# Altium schematic sheet 3.3V_&_5V_DC-DC_PowerSupply.SchDoc
size Letter
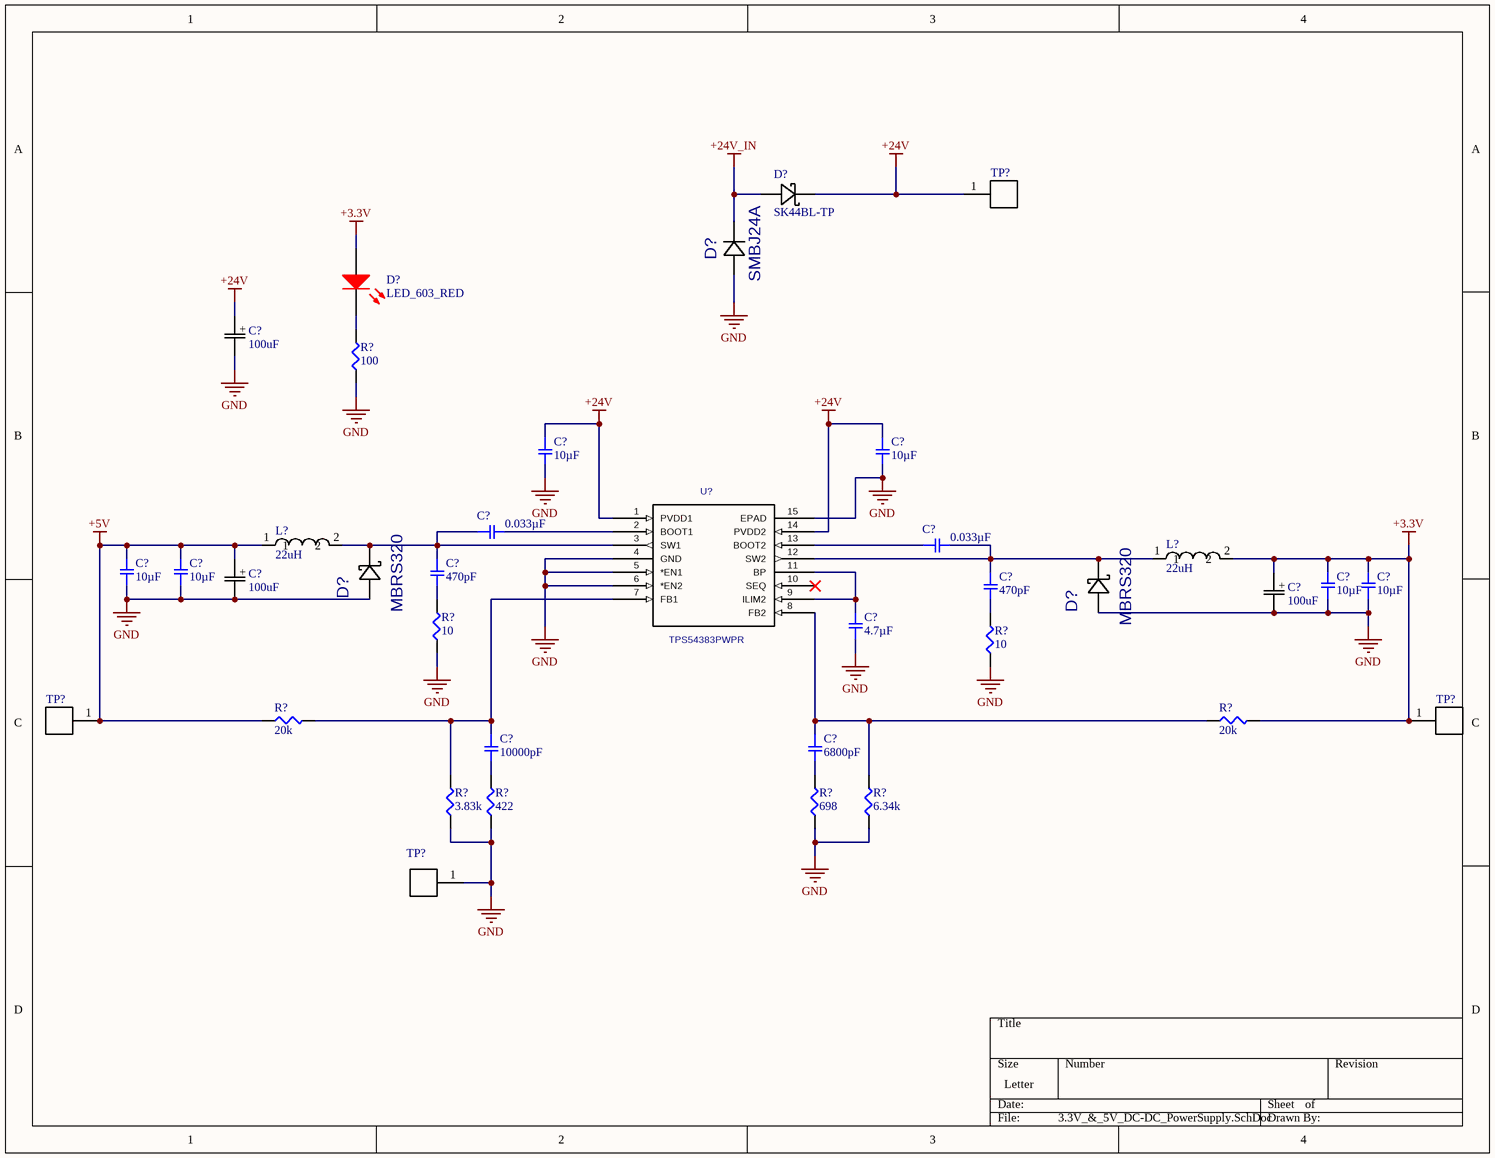
[diagram p0: 3.3V_&_5V_DC-DC_PowerSupply.SchDoc]

## Parts
(Parts that share a designator on the sheet are numbered #1, #2 ... from top to bottom, then left to right.)
C?#1  100uF  [Capacitor SMD 6.6mm]
C?#2  10µF  [SMD-1206C]
C?#3  10µF  [SMD-1206C]
C?#4  0.033µF  [SMD-0603C]
C?#5  0.033µF  [SMD-0603C]
C?#6  100uF  [Capacitor SMD 6.6mm]
C?#7  10µF  [SMD-0603C]
C?#8  10µF  [SMD-0603C]
C?#9  470pF  [SMD-0603C]
C?#10  100uF  [Capacitor SMD 6.6mm]
C?#11  470pF  [SMD-0603C]
C?#12  10µF  [SMD-0603C]
C?#13  10µF  [SMD-0603C]
C?#14  4.7µF  [SMD-0603C]
C?#15  10000pF  [SMD-0603C]
C?#16  6800pF  [SMD-0603C]
D?#1  SK44BL-TP  [SMB]
D?#2  SMBJ24A  [SMB]
D?#3  LED_603_RED  [LED_603]
D?#4  MBRS320  [DIODE_DO214AA]
D?#5  MBRS320  [DIODE_DO214AA]
L?#1  22uH  [Inductor SMD 4mm]
L?#2  22uH  [Inductor SMD 4mm]
R?#1  100  [SMD-0603-RES]
R?#2  10  [SMD-0603-RES]
R?#3  10  [SMD-0603-RES]
R?#4  20k  [SMD-0603-RES]
R?#5  20k  [SMD-0603-RES]
R?#6  3.83k  [SMD-0603-RES]
R?#7  422  [SMD-0603-RES]
R?#8  698  [SMD-0603-RES]
R?#9  6.34k  [SMD-0603-RES]
TP?#1  24V  [TE_RCU-0C]  (value not drawn)
TP?#2  5V  [TE_RCU-0C]  (value not drawn)
TP?#3  3.3V  [TE_RCU-0C]  (value not drawn)
TP?#4  GND  [TE_RCU-0C]  (value not drawn)
U?  TPS54383PWPR  [PWP14_2P31X2P400]

## Nets
+3.3V: C?#10.1 C?#12.2 C?#13.2 D?#3.1(A) L?#2.2 R?#5.2 TP?#3.1
+5V: C?#6.1 C?#7.2 C?#8.2 L?#1.1 R?#4.1 TP?#2.1
+24V: C?#1.1 C?#2.1 C?#3.1 D?#1.1 TP?#1.1 U?.1(PVDD1) U?.14(PVDD2)
+24V_IN: D?#1.2 D?#2.1
GND: C?#1.2 C?#2.2 C?#3.2 C?#6.2 C?#7.1 C?#8.1 C?#10.2 C?#12.1 C?#13.1 C?#14.1 D?#2.2 D?#4.2 D?#5.2 R?#1.1 R?#2.1 R?#3.1 R?#6.1 R?#7.1 R?#8.1 R?#9.1 TP?#4.1 U?.4(GND) U?.5(*EN1) U?.6(*EN2) U?.15(EPAD)
NetC?#4_1: C?#4.1 C?#9.1 D?#4.1 L?#1.2 U?.3(SW1)
NetC?#4_2: C?#4.2 U?.2(BOOT1)
NetC?#5_1: C?#5.1 U?.13(BOOT2)
NetC?#5_2: C?#5.2 C?#11.1 D?#5.1 L?#2.1 U?.12(SW2)
NetC?#9_2: C?#9.2 R?#2.2
NetC?#11_2: C?#11.2 R?#3.2
NetC?#14_2: C?#14.2 U?.9(ILIM2) U?.11(BP)
NetC?#15_1: C?#15.1 R?#4.2 R?#6.2 U?.7(FB1)
NetC?#15_2: C?#15.2 R?#7.2
NetC?#16_1: C?#16.1 R?#5.1 R?#9.2 U?.8(FB2)
NetC?#16_2: C?#16.2 R?#8.2
NetD?#3_2: D?#3.2(K) R?#1.2

Not connected (* = marked no-connect by the designer): U? 10(SEQ)*

## Notes on the sheet
- (in symbol Capacitor SMD 6.6mm) +

## Library data of the parts
C?#1 C?#6 C?#10 = Capacitor SMD 6.6mm
C?#2 C?#3 = GRM31CR61H106KA12L: CAP CER 10UF 50V X5R 1206; Manufacturer: Murata Electronics North America; Factory Stock: 0; Unit Price (USD): 0.65; Minimum Quantity: 1; Tolerance: ±10%; Datasheets: http://www.murata.com/~/media/webrenewal/support/library/catalog/products/capacitor/mlcc/c02e.pdf; Image: //media.digikey.com/Renders/Murata%20Renders/GR331BD72E473KW01L.jpg; Digi-Key Part Number: 490-5961-1-ND; Part Number: GRM31CR61H106KA12L; Quantity Available: 86736; @ qty: 0; Packaging: Cut Tape (CT); Series: GRM; Part Status: Active; Value: 10µF; Voltage: 50V; Temperature Coefficient: X5R; Operating Temperature: -55°C ~ 85°C; Features: -; Ratings: -; Applications: General Purpose; Mounting Type: Surface Mount, MLCC; Package / Case: 1206 (3216 Metric); Size / Dimension: 0.126" L x 0.063" W (3.20mm x 1.60mm); Height - Seated (Max): -; Thickness (Max): 0.071" (1.80mm); Lead Spacing: -; Lead Style: -
C?#4 C?#5 = GCJ188R71H333KA12D: CAP CER 0.033UF 50V X7R 0603; Manufacturer: Murata Electronics North America; Factory Stock: 0; Unit Price (USD): 0.23; Minimum Quantity: 1; Tolerance: ±10%; Datasheets: http://www.murata.com/~/media/webrenewal/support/library/catalog/products/capacitor/mlcc/c03e.ashx; Image: //media.digikey.com/Renders/Murata%20Renders/0603%28LQG18%29.jpg; Digi-Key Part Number: 490-5852-1-ND; Part Number: GCJ188R71H333KA12D; Quantity Available: 16459; @ qty: 0; Packaging: Cut Tape (CT); Series: GCJ; Part Status: Active; Value: 0.033µF; Voltage: 50V; Temperature Coefficient: X7R; Operating Temperature: -55°C ~ 125°C; Features: Soft Termination; Ratings: AEC-Q200; Applications: Automotive, Boardflex Sensitive; Mounting Type: Surface Mount, MLCC; Package / Case: 0603 (1608 Metric); Size / Dimension: 0.063" L x 0.031" W (1.60mm x 0.80mm); Height - Seated (Max): -; Thickness (Max): 0.031" (0.80mm); Lead Spacing: -; Lead Style: -
C?#7 C?#8 C?#12 C?#13 = GRM185R60J106ME15D: CAP CER 10UF 6.3V X5R 0603; Manufacturer: Murata Electronics North America; Factory Stock: 0; Unit Price (USD): 0.36; Minimum Quantity: 1; Tolerance: ±20%; Datasheets: http://www.murata.com/~/media/webrenewal/support/library/catalog/products/capacitor/mlcc/c02e.pdf; Image: //media.digikey.com/Renders/Murata%20Renders/ZRB-SERIES-0402.jpg; Digi-Key Part Number: 490-10467-1-ND; Part Number: GRM185R60J106ME15D; Quantity Available: 25068; @ qty: 0; Packaging: Cut Tape (CT); Series: GRM; Part Status: Active; Value: 10µF; Voltage: 6.3V; Temperature Coefficient: X5R; Operating Temperature: -55°C ~ 85°C; Features: Derating Recommended; Ratings: -; Applications: General Purpose; Mounting Type: Surface Mount, MLCC; Package / Case: 0603 (1608 Metric); Size / Dimension: 0.063" L x 0.031" W (1.60mm x 0.80mm); Height - Seated (Max): -; Thickness (Max): 0.022" (0.55mm); Lead Spacing: -; Lead Style: -
C?#9 C?#11 = GCM1885C1H471JA16D: CAP CER 470PF 50V NP0 0603; Manufacturer: Murata Electronics North America; Factory Stock: 0; Unit Price (USD): 0.1; Minimum Quantity: 1; Tolerance: ±5%; Temperature Coefficient: C0G, NP0; Datasheets: http://www.murata.com/~/media/webrenewal/support/library/catalog/products/capacitor/mlcc/c03e.ashx; Image: //media.digikey.com/Renders/Murata%20Renders/0603%28GCM188%29.jpg; Digi-Key Part Number: 490-4965-1-ND; Part Number: GCM1885C1H471JA16D; Quantity Available: 32645; @ qty: 0; Packaging: Cut Tape (CT); Series: GCM; Part Status: Active; Value: 470pF; Voltage: 50V; Operating Temperature: -55°C ~ 125°C; Features: -; Ratings: AEC-Q200; Applications: Automotive; Mounting Type: Surface Mount, MLCC; Package / Case: 0603 (1608 Metric); Size / Dimension: 0.063" L x 0.031" W (1.60mm x 0.80mm); Height - Seated (Max): -; Thickness (Max): 0.035" (0.90mm); Lead Spacing: -; Lead Style: -
C?#14 = GRJ188C70J475KE11D: CAP CER 4.7UF 6.3V X7S 0603; Manufacturer: Murata Electronics North America; Factory Stock: 0; Unit Price (USD): 0.34; Minimum Quantity: 1; Tolerance: ±10%; Datasheets: http://www.murata.com/~/media/webrenewal/support/library/catalog/products/capacitor/mlcc/c02e.pdf; Image: //media.digikey.com/Renders/Murata%20Renders/0603%28LQG18%29.jpg; Digi-Key Part Number: 490-10884-1-ND; Part Number: GRJ188C70J475KE11D; Quantity Available: 9234; @ qty: 0; Packaging: Cut Tape (CT); Series: GRJ; Part Status: Active; Value: 4.7µF; Voltage: 6.3V; Temperature Coefficient: X7S; Operating Temperature: -55°C ~ 125°C; Features: Soft Termination; Ratings: -; Applications: Boardflex Sensitive; Mounting Type: Surface Mount, MLCC; Package / Case: 0603 (1608 Metric); Size / Dimension: 0.063" L x 0.031" W (1.60mm x 0.80mm); Height - Seated (Max): -; Thickness (Max): 0.039" (1.00mm); Lead Spacing: -; Lead Style: -
C?#15 = GCJ188R71H103KA01D: CAP CER 10000PF 50V X7R 0603; Manufacturer: Murata Electronics North America; Factory Stock: 0; Unit Price (USD): 0.19; Minimum Quantity: 1; Tolerance: ±10%; Datasheets: http://www.murata.com/~/media/webrenewal/support/library/catalog/products/capacitor/mlcc/c03e.ashx; Image: //media.digikey.com/Renders/Murata%20Renders/0603%28LQG18%29.jpg; Digi-Key Part Number: 490-5762-1-ND; Part Number: GCJ188R71H103KA01D; Quantity Available: 34868; @ qty: 0; Packaging: Cut Tape (CT); Series: GCJ; Part Status: Active; Value: 10000pF; Voltage: 50V; Temperature Coefficient: X7R; Operating Temperature: -55°C ~ 125°C; Features: Soft Termination; Ratings: AEC-Q200; Applications: Automotive, Boardflex Sensitive; Mounting Type: Surface Mount, MLCC; Package / Case: 0603 (1608 Metric); Size / Dimension: 0.063" L x 0.031" W (1.60mm x 0.80mm); Height - Seated (Max): -; Thickness (Max): 0.031" (0.80mm); Lead Spacing: -; Lead Style: -
C?#16 = GCM188R71H682KA37D: CAP CER 6800PF 50V X7R 0603; Manufacturer: Murata Electronics North America; Factory Stock: 0; Unit Price (USD): 0.1; Minimum Quantity: 1; Tolerance: ±10%; Datasheets: http://www.murata.com/~/media/webrenewal/support/library/catalog/products/capacitor/mlcc/c03e.ashx; Image: //media.digikey.com/Renders/Murata%20Renders/0603%28GCM188%29.jpg; Digi-Key Part Number: 490-6055-1-ND; Part Number: GCM188R71H682KA37D; Quantity Available: 31753; @ qty: 0; Packaging: Cut Tape (CT); Series: GCM; Part Status: Active; Value: 6800pF; Voltage: 50V; Temperature Coefficient: X7R; Operating Temperature: -55°C ~ 125°C; Features: -; Ratings: AEC-Q200; Applications: Automotive; Mounting Type: Surface Mount, MLCC; Package / Case: 0603 (1608 Metric); Size / Dimension: 0.063" L x 0.031" W (1.60mm x 0.80mm); Height - Seated (Max): -; Thickness (Max): 0.035" (0.90mm); Lead Spacing: -; Lead Style: -
D?#2 = SMBJ24A: C: Copyright (C) 2015 Accelerated Designs. All rights reserved; Vendor: Bourns Electronics; Built_By: EMA_UL_Team; Manufacturer_Part_Number: SMBJ24A; Value: SMBJ24A
D?#4 D?#5 = Schottky Diode SMC: C: Copyright (C) 2015 Accelerated Designs. All rights reserved; Vendor: Vishay; Built_By: EMA_UL_Team; Manufacturer_Part_Number: MBRS320
L?#1 L?#2 = Inductor SMD 4mm
R?#1 = ERJ-3EKF1000V: RES SMD 100 OHM 1% 1/10W 0603; Manufacturer: Panasonic Electronic Components; Factory Stock: 0; Unit Price (USD): 0.00379; @ qty: 1500; Minimum Quantity: 1; Power (Watts): 0.1W, 1/10W; Temperature Coefficient: ±100ppm/°C; Part Number: ERJ-3EKF1000V; Datasheets: http://industrial.panasonic.com/www-cgi/jvcr13pz.cgi?E+PZ+3+AOA0002+ERJ3EKF1000V+7+WW; Image: //media.digikey.com/Photos/Panasonic%20Photos/MFG_ERJ-P6W%20Series.jpg; Digi-Key Part Number: P100HCT-ND; Quantity Available: 1544120; Packaging: Cut Tape (CT); Series: ERJ; Part Status: Active; Value: 100; Tolerance: ±1%; Composition: Thick Film; Features: Automotive AEC-Q200; Operating Temperature: -55°C ~ 155°C; Package / Case: 0603 (1608 Metric); Supplier Device Package: 0603; Size / Dimension: 0.063" L x 0.031" W (1.60mm x 0.80mm); Height - Seated (Max): 0.022" (0.55mm); Number of Terminations: 2; Failure Rate: -
R?#2 R?#3 = ERJ-3GEYJ100V: RES SMD 10 OHM 5% 1/10W 0603; Manufacturer: Panasonic Electronic Components; Factory Stock: 0; Unit Price (USD): 0.00321; @ qty: 1500; Minimum Quantity: 1; Power (Watts): 0.1W, 1/10W; Temperature Coefficient: ±200ppm/°C; Part Number: ERJ-3GEYJ100V; Datasheets: http://industrial.panasonic.com/www-cgi/jvcr13pz.cgi?E+PZ+3+AOA0001+ERJ3GEYJ100V+7+WW; Image: //media.digikey.com/Photos/Panasonic%20Photos/MFG_ERJ-P6W%20Series.jpg; Digi-Key Part Number: P10GCT-ND; Quantity Available: 77399; Packaging: Cut Tape (CT); Series: ERJ; Part Status: Active; Value: 10; Tolerance: ±5%; Composition: Thick Film; Features: Automotive AEC-Q200; Operating Temperature: -55°C ~ 155°C; Package / Case: 0603 (1608 Metric); Supplier Device Package: 0603; Size / Dimension: 0.063" L x 0.031" W (1.60mm x 0.80mm); Height - Seated (Max): 0.022" (0.55mm); Number of Terminations: 2; Failure Rate: -
R?#4 R?#5 = ERJ-3EKF2002V: RES SMD 20K OHM 1% 1/10W 0603; Manufacturer: Panasonic Electronic Components; Factory Stock: 0; Unit Price (USD): 0.00379; @ qty: 1500; Minimum Quantity: 1; Power (Watts): 0.1W, 1/10W; Temperature Coefficient: ±100ppm/°C; Part Number: ERJ-3EKF2002V; Datasheets: http://industrial.panasonic.com/www-cgi/jvcr13pz.cgi?E+PZ+3+AOA0002+ERJ3EKF2002V+7+WW; Image: //media.digikey.com/Photos/Panasonic%20Photos/MFG_ERJ-P6W%20Series.jpg; Digi-Key Part Number: P20.0KHCT-ND; Quantity Available: 1063743; Packaging: Cut Tape (CT); Series: ERJ; Part Status: Active; Value: 20k; Tolerance: ±1%; Composition: Thick Film; Features: Automotive AEC-Q200; Operating Temperature: -55°C ~ 155°C; Package / Case: 0603 (1608 Metric); Supplier Device Package: 0603; Size / Dimension: 0.063" L x 0.031" W (1.60mm x 0.80mm); Height - Seated (Max): 0.022" (0.55mm); Number of Terminations: 2; Failure Rate: -
R?#6 = ERJ-3EKF3831V: RES SMD 3.83K OHM 1% 1/10W 0603; Manufacturer: Panasonic Electronic Components; Factory Stock: 0; Unit Price (USD): 0.00379; @ qty: 1500; Minimum Quantity: 1; Power (Watts): 0.1W, 1/10W; Temperature Coefficient: ±100ppm/°C; Part Number: ERJ-3EKF3831V; Datasheets: http://industrial.panasonic.com/www-cgi/jvcr13pz.cgi?E+PZ+3+AOA0002+ERJ3EKF3831V+7+WW; Image: //media.digikey.com/Photos/Panasonic%20Photos/MFG_ERJ-P6W%20Series.jpg; Digi-Key Part Number: P3.83KHCT-ND; Quantity Available: 75038; Packaging: Cut Tape (CT); Series: ERJ; Part Status: Active; Value: 3.83k; Tolerance: ±1%; Composition: Thick Film; Features: Automotive AEC-Q200; Operating Temperature: -55°C ~ 155°C; Package / Case: 0603 (1608 Metric); Supplier Device Package: 0603; Size / Dimension: 0.063" L x 0.031" W (1.60mm x 0.80mm); Height - Seated (Max): 0.022" (0.55mm); Number of Terminations: 2; Failure Rate: -
R?#7 = ERJ-3EKF4220V: RES SMD 422 OHM 1% 1/10W 0603; Manufacturer: Panasonic Electronic Components; Factory Stock: 0; Unit Price (USD): 0.00379; @ qty: 1500; Minimum Quantity: 1; Power (Watts): 0.1W, 1/10W; Temperature Coefficient: ±100ppm/°C; Part Number: ERJ-3EKF4220V; Datasheets: http://industrial.panasonic.com/www-cgi/jvcr13pz.cgi?E+PZ+3+AOA0002+ERJ3EKF4220V+7+WW; Image: //media.digikey.com/Photos/Panasonic%20Photos/MFG_ERJ-P6W%20Series.jpg; Digi-Key Part Number: P422HCT-ND; Quantity Available: 70589; Packaging: Cut Tape (CT); Series: ERJ; Part Status: Active; Value: 422; Tolerance: ±1%; Composition: Thick Film; Features: Automotive AEC-Q200; Operating Temperature: -55°C ~ 155°C; Package / Case: 0603 (1608 Metric); Supplier Device Package: 0603; Size / Dimension: 0.063" L x 0.031" W (1.60mm x 0.80mm); Height - Seated (Max): 0.022" (0.55mm); Number of Terminations: 2; Failure Rate: -
R?#8 = ERJ-3EKF6980V: RES SMD 698 OHM 1% 1/10W 0603; Manufacturer: Panasonic Electronic Components; Factory Stock: 0; Unit Price (USD): 0.00379; @ qty: 1500; Minimum Quantity: 1; Power (Watts): 0.1W, 1/10W; Temperature Coefficient: ±100ppm/°C; Part Number: ERJ-3EKF6980V; Datasheets: http://industrial.panasonic.com/www-cgi/jvcr13pz.cgi?E+PZ+3+AOA0002+ERJ3EKF6980V+7+WW; Image: //media.digikey.com/Photos/Panasonic%20Photos/MFG_ERJ-P6W%20Series.jpg; Digi-Key Part Number: P698HCT-ND; Quantity Available: 47003; Packaging: Cut Tape (CT); Series: ERJ; Part Status: Active; Value: 698; Tolerance: ±1%; Composition: Thick Film; Features: Automotive AEC-Q200; Operating Temperature: -55°C ~ 155°C; Package / Case: 0603 (1608 Metric); Supplier Device Package: 0603; Size / Dimension: 0.063" L x 0.031" W (1.60mm x 0.80mm); Height - Seated (Max): 0.022" (0.55mm); Number of Terminations: 2; Failure Rate: -
R?#9 = ERJ-3EKF6341V: RES SMD 6.34K OHM 1% 1/10W 0603; Manufacturer: Panasonic Electronic Components; Factory Stock: 0; Unit Price (USD): 0.00379; @ qty: 1500; Minimum Quantity: 1; Power (Watts): 0.1W, 1/10W; Temperature Coefficient: ±100ppm/°C; Part Number: ERJ-3EKF6341V; Datasheets: http://industrial.panasonic.com/www-cgi/jvcr13pz.cgi?E+PZ+3+AOA0002+ERJ3EKF6341V+7+WW; Image: //media.digikey.com/Photos/Panasonic%20Photos/MFG_ERJ-P6W%20Series.jpg; Digi-Key Part Number: P6.34KHCT-ND; Quantity Available: 97312; Packaging: Cut Tape (CT); Series: ERJ; Part Status: Active; Value: 6.34k; Tolerance: ±1%; Composition: Thick Film; Features: Automotive AEC-Q200; Operating Temperature: -55°C ~ 155°C; Package / Case: 0603 (1608 Metric); Supplier Device Package: 0603; Size / Dimension: 0.063" L x 0.031" W (1.60mm x 0.80mm); Height - Seated (Max): 0.022" (0.55mm); Number of Terminations: 2; Failure Rate: -
TP?#1-TP?#4 = RCU-0C: 0603 PROBE PAD; Power_Rating: 0 W; Resistance: <.05; MF: TE Connectivity; Tolerance: 0%; Digi-Key_Part_Number: A106145CT-ND; EU_RoHS_Compliance: Compliant; Digi-Key_Purchase_URL: https://www.digikey.com/product-detail/en/te-connectivity-amp-connectors/RCU-0C/A106145CT-ND/3477802?utm_source=snapeda&utm_medium=aggregator&utm_campaign=symbol; SnapEDA_Link: https://www.snapeda.com/parts/RCU-0C/TE%20Connectivity%20AMP%20Connectors/view-part/?ref=snap; Link: http://www.te.com/usa-en/product-1625854-3.html; MP: RCU-0C; Package: 0603; Value: *
U? = TPS54383PWPR: C: Copyright (C) 2015 Accelerated Designs. All rights reserved; Vendor: Texas Instruments; Built_By: EMA_UL_Team; Value: TPS54383PWPR; Manufacturer_Part_Number: TPS54383PWPR; Manufacturer: Texas Instruments